# Altium project PCB_PhatNRF_MatrixKey.PrjPcb
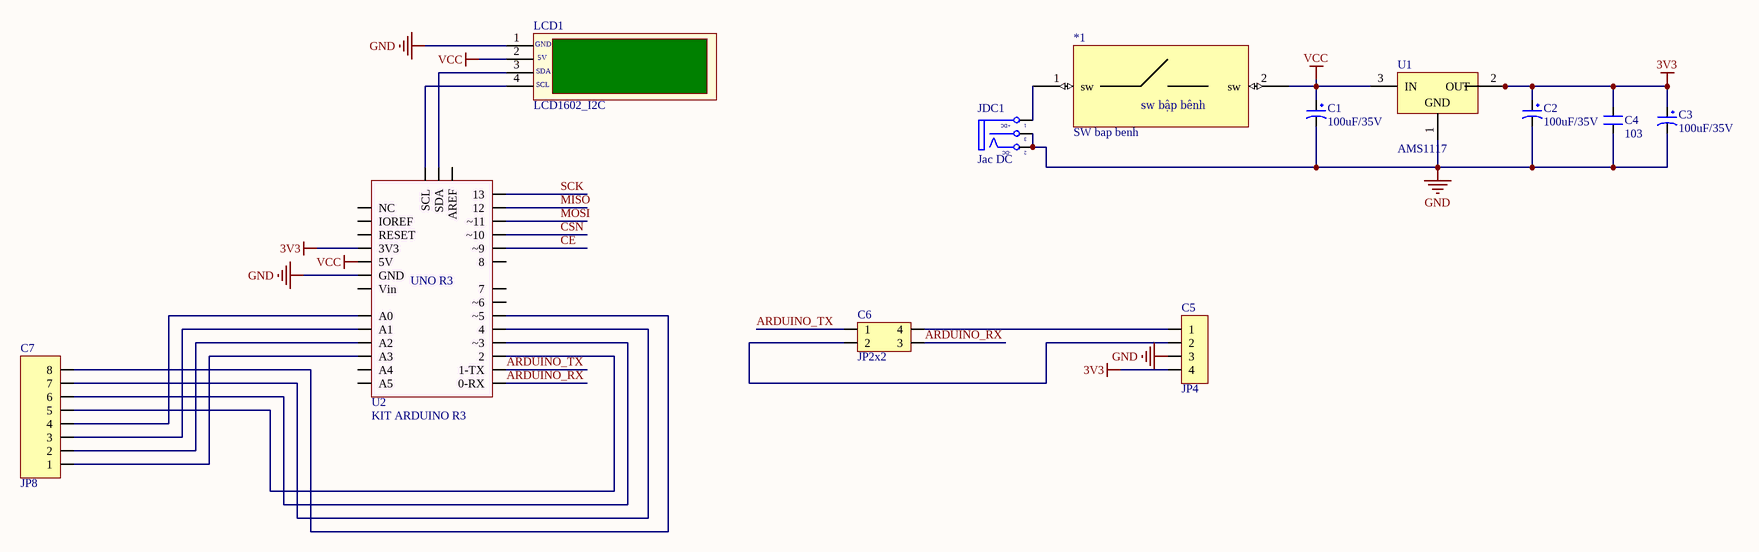
[diagram p0: PhatNRF_MatrixKey.SchDoc]
1 sheet, 12 parts. Net scope: global (net labels, ports and power ports of the same name join across sheets).
Board file: PhatNRF_MatrixKey.PcbDoc

## Sheet PhatNRF_MatrixKey.SchDoc
size A0

### Parts
*1  SW bap benh  [SW bapbenh]
C1  100uF/35V  [CP1.5/3.4]
C2  100uF/35V  [CP1.5/3.4]
C3  100uF/35V  [CP1.5/3.4]
C4  103  [SM-0805]
C5  JP4  [JP4-C1T]
C6  JP2x2  [JP2-C2T]
C7  JP8  [JP8-C1C]
JDC1  Jac DC  [DC0]
LCD1  LCD1602_I2C  [LCD1602_I2C]
U1  AMS1117  [SOT223]
U2  KIT ARDUINO R3  [Arduino UNO R3 - v1]

### Nets
3V3: C2.1 C3.1 C4.2 C5.4 U1.2(OUT) U1.4 U2.3V3
GND: C1.2 C2.2 C3.2 C4.1 C5.3 JDC1.2(TN) JDC1.3(S) LCD1.1(GND) U1.1(GND) U2.GND
VCC: *1.2(sw) C1.1 LCD1.2(VCC) U1.3(IN) U2.5V
ARDUINO_RX: C6.3 U2.0-RX
ARDUINO_TX: C6.1 U2.1-TX
CE: U2.~9
CSN: U2.~10
MISO: U2.12
MOSI: U2.~11
SCK: U2.13
Net*1_1: *1.1(sw) JDC1.1(T)
NetC5_1: C5.1 C6.4
NetC5_2: C5.2 C6.2
NetC7_1: C7.1 U2.A3
NetC7_2: C7.2 U2.A2
NetC7_3: C7.3 U2.A1
NetC7_4: C7.4 U2.A0
NetC7_5: C7.5 U2.2
NetC7_6: C7.6 U2.~3
NetC7_7: C7.7 U2.4
NetC7_8: C7.8 U2.~5
NetLCD1_3: LCD1.3(SDA) U2.SDA
NetLCD1_4: LCD1.4(SCL) U2.SCL

Not connected (* = marked no-connect by the designer): U2 7 8 A4 A5 AREF IOREF NC RESET Vin ~6

### Notes on the sheet
- (in symbol DCIN) +DC; -DC
- (in symbol KIT ARDUINO R3) UNO R3
- (in symbol LCD1602_I2C) 5V
- (in symbol SW bap benh) sw bập bênh

### Library data of the parts
C1-C3 = CP3: Cap 100uF/35V - 470uF/16V; Value: 100uF/35V/50V; Description 1: 1000uF/6,3V - 470uF/16V - 330uF - 25V; Description 2: 220uF/35V - 100uF/50V - 63V - 4,7uF/200V; Description 3: 22uF => 33uF100V - 3,3uF => 4,7uF/250V; Description 4: 2,2uF =>3,3uF/350 - 2,2uF/400V - 1uF/450V
C4 = CM: Cap SMD; Value: 103
C5 = JP4: WR-PHD 2.54 mm Angled Socket Header; Manufacturer: W¨¹rth Elektronik eiSos GmbH; partNo: 613004143121; ComponentLink1 Description: Manufacturer; ComponentLink2 Description: Datasheet; NoPins: 04; Created Date: 29 March 2013; ComponentLink1URL: http://www.we-online.com; ComponentLink2URL: http://katalog.we-online.de/em/datasheet/6130xx143121.pdf; Created by: Karrer Zheng
C6 = JP2x2: WR-PHD 2.54 mm Dual Socket Header; Manufacturer: W¨¹rth Elektronik eiSos GmbH; partNo: 61300421821; ComponentLink1 Description: Manufacturer; ComponentLink2 Description: Datasheet; NoPins: 04; Created Date: 29 March 2013; ComponentLink1URL: http://www.we-online.com; ComponentLink2URL: http://katalog.we-online.de/em/datasheet/6130xx21821.pdf; Created by: Karrer Zheng
C7 = JP8: WR-PHD 2.54 mm Angled Socket Header; Manufacturer: W¨¹rth Elektronik eiSos GmbH; partNo: 613008143121; ComponentLink1 Description: Manufacturer; ComponentLink2 Description: Datasheet; NoPins: 08; Created Date: 29 March 2013; ComponentLink1URL: http://www.we-online.com; ComponentLink2URL: http://katalog.we-online.de/em/datasheet/6130xx143121.pdf; Created by: Karrer Zheng
JDC1 = DCIN: Jac DC input; Value: Jac DC
U1 = AMS117
U2 = KIT ARDUINO R3: ARDUINO  R3 ATMEGA328, ARDUINO UNO, EVAL BOARD